# EAGLE schematic n64rgbv2 (EAGLE 8.4.3)
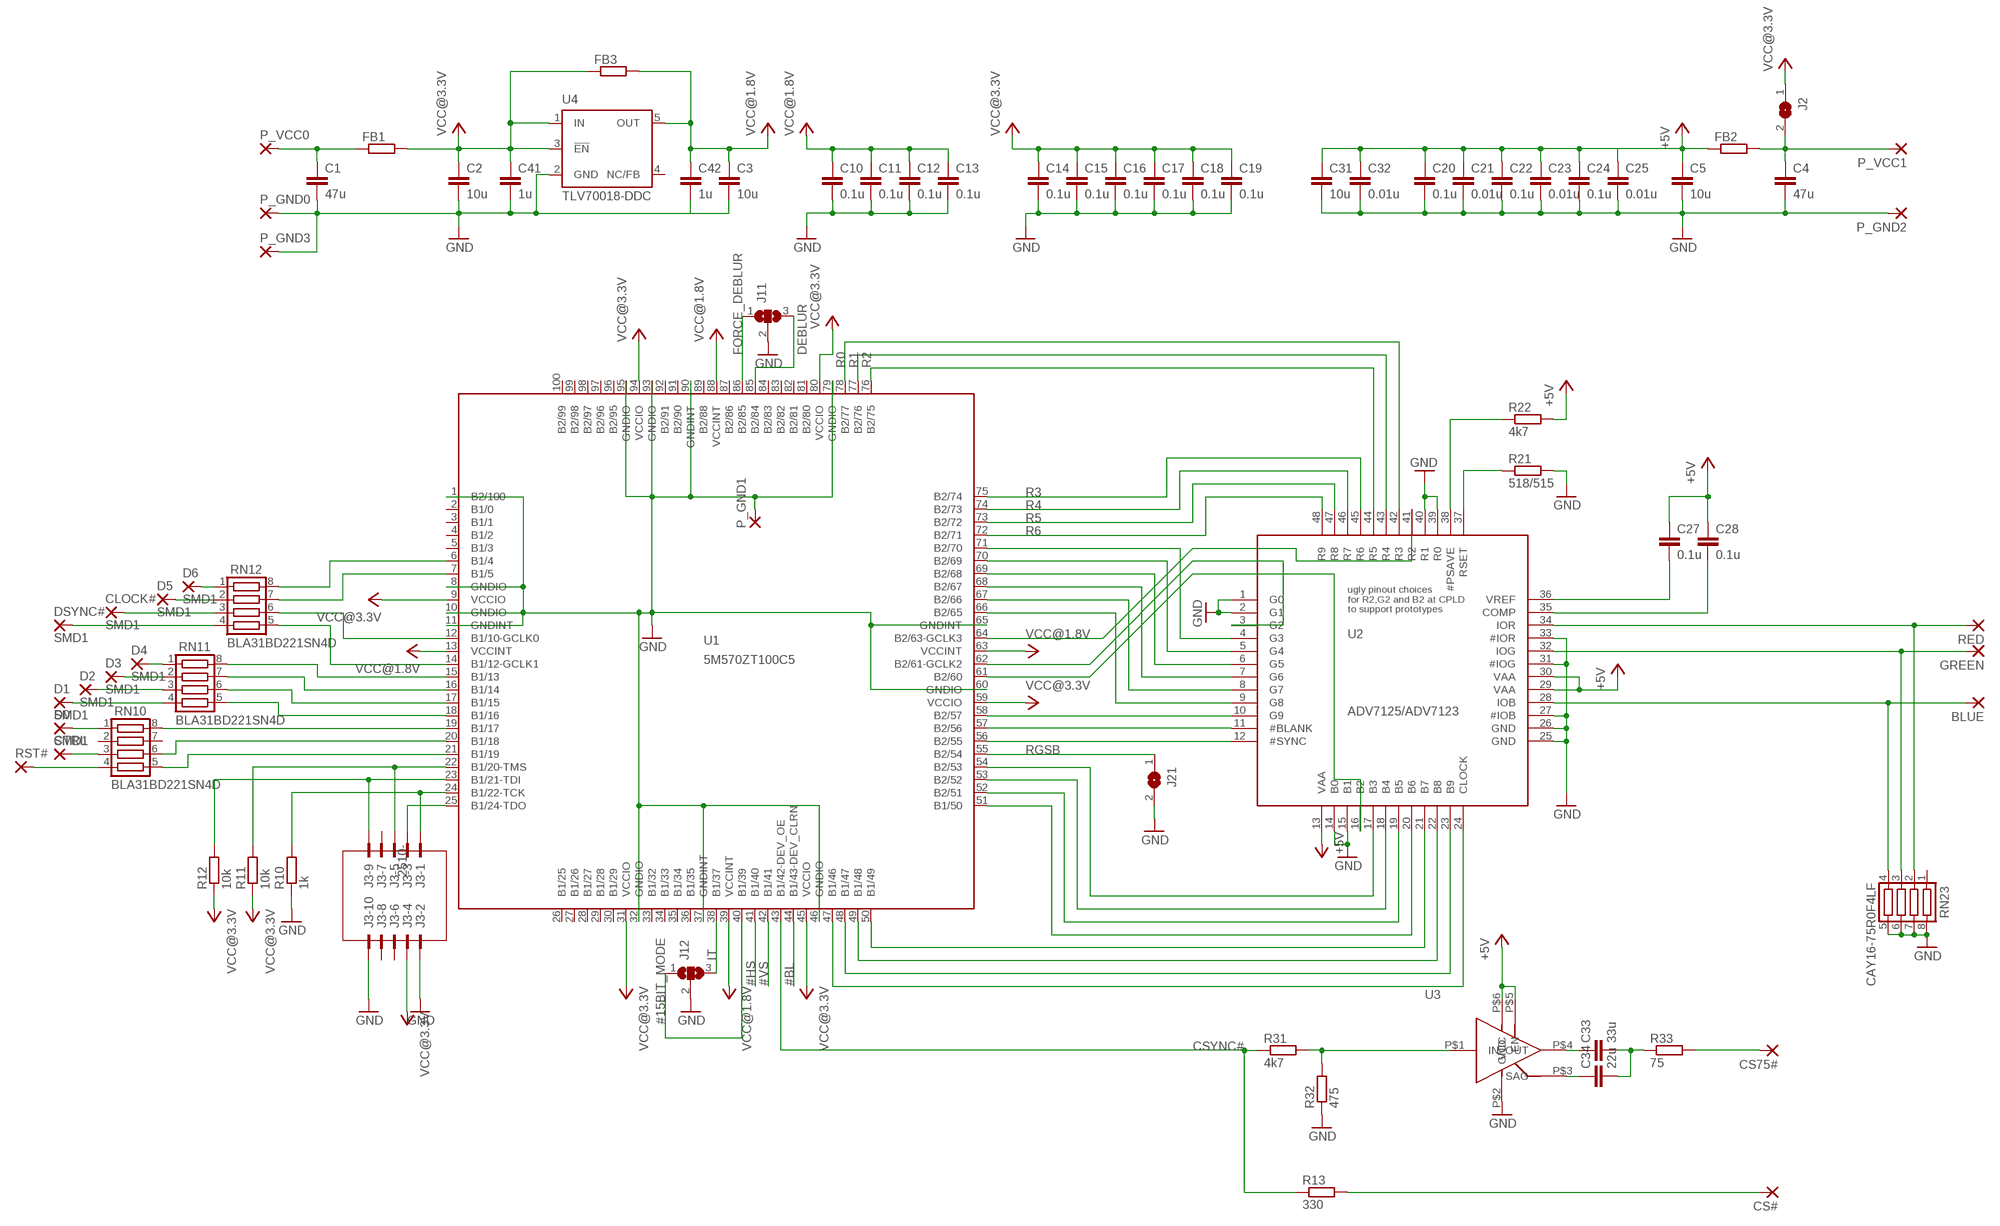
[diagram p0: schematic, sheet 1]

## Parts
BLUE  SMD2  [SMD1,27-2,54]
C1  47u  C-EUC0805  [C0805]
C2  10u  C-EUC0805  [C0805]
C3  10u  C-EUC0805  [C0805]
C4  47u  C-EUC0805  [C0805]
C5  10u  C-EUC0805  [C0805]
C10  0.1u  C-EUC0603  [C0603]
C11  0.1u  C-EUC0603  [C0603]
C12  0.1u  C-EUC0603  [C0603]
C13  0.1u  C-EUC0603  [C0603]
C14  0.1u  C-EUC0603  [C0603]
C15  0.1u  C-EUC0603  [C0603]
C16  0.1u  C-EUC0603  [C0603]
C17  0.1u  C-EUC0603  [C0603]
C18  0.1u  C-EUC0603  [C0603]
C19  0.1u  C-EUC0603  [C0603]
C20  0.1u  C-EUC0603  [C0603]
C21  0.01u  C-EUC0603  [C0603]
C22  0.1u  C-EUC0603  [C0603]
C23  0.01u  C-EUC0603  [C0603]
C24  0.1u  C-EUC0603  [C0603]
C25  0.01u  C-EUC0603  [C0603]
C27  0.1u  C-EUC0603  [C0603]
C28  0.1u  C-EUC0603  [C0603]
C31  10u  C-EUC0805  [C0805]
C32  0.01u  C-EUC0603  [C0603]
C33  33u  C-EUC1210  [C1210]
C34  22u  C-EUC1206  [C1206]
C41  1u  C-EUC0603  [C0603]
C42  1u  C-EUC0603  [C0603]
CLOCK#  SMD1  [SMD0,8-1,6]
CS75#  SMD2  [SMD1,27-2,54]
CS#  SMD2  [SMD1,27-2,54]
CTRL  SMD2  [SMD1,27-2,54]
D0  SMD1  [SMD0,8-1,6]
D1  SMD1  [SMD0,8-1,6]
D2  SMD1  [SMD0,8-1,6]
D3  SMD1  [SMD0,8-1,6]
D4  SMD1  [SMD0,8-1,6]
D5  SMD1  [SMD0,8-1,6]
D6  SMD1  [SMD0,8-1,6]
DSYNC#  SMD1  [SMD0,8-1,6]
FB1  R-EU_R0603  [R0603]
FB2  R-EU_R0603  [R0603]
FB3  R-EU_R0603  [R0603]
GREEN  SMD2  [SMD1,27-2,54]
J2  SJ  [SJ]
J3  2510-  [PAK100/2500-10]
J11  SJ2W  [SJ_2]
J12  SJ2W  [SJ_2]
J21  SJ  [SJ]
P_GND0  SMD2  [SMD1,27-2,54]
P_GND1  SMD2  [SMD1,27-2,54]
P_GND2  SMD2  [SMD1,27-2,54]
P_GND3  SMD2  [SMD1,27-2,54]
P_VCC0  SMD2  [SMD1,27-2,54]
P_VCC1  SMD2  [SMD1,27-2,54]
R10  1k  R-EU_R0603  [R0603]
R11  10k  R-EU_R0603  [R0603]
R12  10k  R-EU_R0603  [R0603]
R13  330  R-EU_R0603  [R0603]
R21  518/515  R-EU_R0603  [R0603]
R22  4k7  R-EU_R0603  [R0603]
R31  4k7  R-EU_R0603  [R0603]
R32  475  R-EU_R0603  [R0603]
R33  75  R-EU_R0603  [R0603]
RED  SMD2  [SMD1,27-2,54]
RN10  BLA31BD221SN4D  CTS742C083  [CTS742C083]
RN11  BLA31BD221SN4D  CTS742C083  [CTS742C083]
RN12  BLA31BD221SN4D  CTS742C083  [CTS742C083]
RN23  CAY16-75R0F4LF  CTS742C083  [CTS742C083]
RST#  SMD2  [SMD1,27-2,54]
U1  5M570ZT100C5  [TQFP100]
U2  ADV7125/ADV7123  ADV7123  [LQFP48]
U3  TSH122ICT  [SC70]
U4  TLV70018-DDC  TPS77018  [SOT23-DBV]

## Nets
#15BIT_MODE: J12.1 U1.40(B1/39)
#BL: U1.44(B1/43-DEV_CLRN)
#HS: U1.41(B1/40)
#VS: U1.42(B1/41)
+5V: C5.1 C20.1 C21.1 C22.1 C23.1 C24.1 C25.1 C27.1 C28.1 C31.1 C32.1 FB2.1 R22.2 U2.13(VAA) U2.29(VAA) U2.30(VAA) U3.P$5(EN) U3.P$6(VCC)
BLUE: BLUE.1(P) RN23.4 U2.28(IOB)
CSYNC#: R13.1 R31.1 U1.43(B1/42-DEV_OE)
DEBLUR: J11.3 U1.85(B2/84)
FORCE_DEBLUR: J11.1 U1.86(B2/85)
GND: C1.2 C2.2 C3.2 C4.2 C5.2 C10.2 C11.2 C12.2 C13.2 C14.2 C15.2 C16.2 C17.2 C18.2 C19.2 C20.2 C21.2 C22.2 C23.2 C24.2 C25.2 C31.2 C32.2 C41.2 C42.2 J3.2 J3.10 J11.2 J12.2 J21.2 P_GND0.1(P) P_GND1.1(P) P_GND2.1(P) P_GND3.1(P) R10.1 R21.2 R32.1 RN23.5 RN23.6 RN23.7 RN23.8 U1.1(B2/100) U1.8(GNDIO) U1.10(GNDIO) U1.11(GNDINT) U1.32(GNDIO) U1.37(GNDINT) U1.46(GNDIO) U1.60(GNDIO) U1.65(GNDINT) U1.79(GNDIO) U1.90(GNDINT) U1.93(GNDIO) U1.95(GNDIO) U2.1(G0) U2.2(G1) U2.14(B0) U2.15(B1) U2.25(GND) U2.26(GND) U2.27(#IOB) U2.31(#IOG) U2.33(#IOR) U2.39(R0) U2.40(R1) U3.P$2(GND) U4.2(GND)
GREEN: GREEN.1(P) RN23.3 U2.32(IOG)
IT: J12.3 U1.38(B1/37)
N$1: D6.P$1(P) RN12.1
N$2: D5.P$1(P) RN12.2
N$3: DSYNC#.P$1(P) RN12.4
N$4: CLOCK#.P$1(P) RN12.3
N$5: RN10.4 RST#.1(P)
N$6: CTRL.1(P) RN10.3
N$7: D0.P$1(P) RN10.1
N$8: RN10.8 U1.19(B1/17)
N$9: RN10.6 U1.20(B1/18)
N$10: RN10.5 U1.21(B1/19)
N$11: RN11.5 U1.18(B1/16)
N$12: RN11.6 U1.17(B1/15)
N$13: CS#.1(P) R13.2
N$14: RN11.7 U1.16(B1/14)
N$15: RN11.8 U1.15(B1/13)
N$16: D1.P$1(P) RN11.4
N$17: D2.P$1(P) RN11.3
N$18: D3.P$1(P) RN11.2
N$19: D4.P$1(P) RN11.1
N$20: RN12.7 U1.7(B1/5)
N$21: RN12.8 U1.6(B1/4)
N$22: RN12.5 U1.14(B1/12-GCLK1)
N$23: RN12.6 U1.12(B1/10-GCLK0)
N$24: U1.71(B2/70) U2.4(G3)
N$25: U1.64(B2/63-GCLK3) U2.41(R2)
N$26: U1.70(B2/69) U2.5(G4)
N$27: U1.69(B2/68) U2.6(G5)
N$28: U1.68(B2/67) U2.7(G6)
N$29: U1.67(B2/66) U2.8(G7)
N$30: U1.66(B2/65) U2.9(G8)
N$31: U1.58(B2/57) U2.10(G9)
N$32: U1.56(B2/55) U2.12(#SYNC)
N$33: U1.47(B1/46) U2.24(CLOCK)
N$34: U1.48(B1/47) U2.23(B9)
N$35: U1.49(B1/48) U2.22(B8)
N$36: U1.50(B1/49) U2.21(B7)
N$37: U1.51(B1/50) U2.20(B6)
N$38: U1.52(B2/51) U2.19(B5)
N$39: U1.53(B2/52) U2.18(B4)
N$40: U1.54(B2/53) U2.17(B3)
N$41: U1.62(B2/61-GCLK2) U2.3(G2)
N$42: U1.57(B2/56) U2.11(#BLANK)
N$43: U1.61(B2/60) U2.16(B2)
N$44: C4.1 FB2.2 J2.2 P_VCC1.1(P)
N$54: C1.1 FB1.1 P_VCC0.1(P)
N$57: C33.2 C34.2 R33.1
N$58: CS75#.1(P) R33.2
N$59: C33.1 U3.P$4(OUT)
N$60: C34.1 U3.P$3(SAG)
N$61: R21.1 U2.37(RSET)
N$62: R22.1 U2.38(#PSAVE)
N$63: C28.2 U2.35(COMP)
N$64: R31.2 R32.2 U3.P$1(IN)
N$88: C27.2 U2.36(VREF)
R0: U1.78(B2/77) U2.42(R3)
R1: U1.77(B2/76) U2.43(R4)
R2: U1.76(B2/75) U2.44(R5)
R3: U1.75(B2/74) U2.45(R6)
R4: U1.74(B2/73) U2.46(R7)
R5: U1.73(B2/72) U2.47(R8)
R6: U1.72(B2/71) U2.48(R9)
RED: RED.1(P) RN23.2 U2.34(IOR)
RGSB: J21.1 U1.55(B2/54)
TCK: J3.1 R10.2 U1.24(B1/22-TCK)
TDI: J3.9 R12.2 U1.23(B1/21-TDI)
TDO: J3.3 U1.25(B1/24-TDO)
TMS: J3.5 R11.2 U1.22(B1/20-TMS)
VCC@1.8V: C3.1 C10.1 C11.1 C12.1 C13.1 C42.1 FB3.2 U1.13(VCCINT) U1.39(VCCINT) U1.63(VCCINT) U1.88(VCCINT) U4.5(OUT)
VCC@3.3V: C2.1 C14.1 C15.1 C16.1 C17.1 C18.1 C19.1 C41.1 FB1.2 FB3.1 J2.1 J3.4 R11.1 R12.1 U1.9(VCCIO) U1.31(VCCIO) U1.45(VCCIO) U1.59(VCCIO) U1.80(VCCIO) U1.94(VCCIO) U4.1(IN) U4.3(!EN)
Unconnected: J3.6 J3.7 J3.8 RN10.2 RN10.7 RN23.1 U1.2(B1/0) U1.3(B1/1) U1.4(B1/2) U1.5(B1/3) U1.26(B1/25) U1.27(B1/26) U1.28(B1/27) U1.29(B1/28) U1.30(B1/29) U1.33(B1/32) U1.34(B1/33) U1.35(B1/34) U1.36(B1/35) U1.81(B2/80) U1.82(B2/81) U1.83(B2/82) U1.84(B2/83) U1.87(B2/86) U1.89(B2/88) U1.91(B2/90) U1.92(B2/91) U1.96(B2/95) U1.97(B2/96) U1.98(B2/97) U1.99(B2/98) U1.100(B2/99) U4.4(NC/FB)

## Notes on the sheet
- ugly pinout choices
  for R2,G2 and B2 at CPLD
  to support prototypes

## Library data of the parts
BLUE CS75# CS# CTRL GREEN P_GND0 P_GND1-P_GND3 P_VCC0 P_VCC1 RED RST# = wirepad:SMD2: SMD PAD
C1-C5 C10-C25 C27 C28 C31 C32 C34 C41 C42 = rcl:C-EU: CAPACITOR, European symbol
C33 = rcl@1:C-EU: CAPACITOR, European symbol
CLOCK# D0 D1-D6 DSYNC# = wirepad:SMD1
FB1-FB3 R10-R13 R21 R22 R31-R33 = rcl:R-EU_: RESISTOR, European symbol
J2 J21 = jumper:SJ: SMD solder JUMPER
J3 = con-3m:2510-: 3M (TM) Pak 100 4-Wall Header Source: 3M; MF: 3M; MPN: 2510-6002UB; OC_FARNELL: 9838244; OC_NEWARK: 46F4725
J11 J12 = jumper:SJ2W: SMD solder JUMPER
RN10-RN12 RN23 = resistor-net:CTS742C083: Chip Resistor Array 4 Single Resistor Source: http://www.ctscorp.com/components/Datasheets/CTSChipArrayDs.pdf; OC_FARNELL: unknown; OC_NEWARK: unknown
U1 = altera:5M570ZT100C5
U2 = analog-devices:ADV7123
U3 = st-microelectronics:TSH122
U4 = texas:TPS770*: ULTRALOW-POWER 50-mA LOW-DROPOUT LINEAR REGULATORS 50-mA Low-Dropout Regulator Source: http://focus.ti.com/lit/ds/symlink/tps77001.pdf; MF: TEXAS INSTRUMENT CONNECTORS; MPN: TPS77018DBVR; OC_FARNELL: 1575745; OC_NEWARK: 77C1176